# Altium schematic sheet connectors.SchDoc: Title
size B; Organization: Midnight Sun Solar Rayce Car Team; Address1: University of Waterloo; Address2: 200 University Ave W; Address3: Waterloo, ON, Canada; Address4: N2L 3E9; Website: www.uwmidsun.com; ProjectName: ProjectName
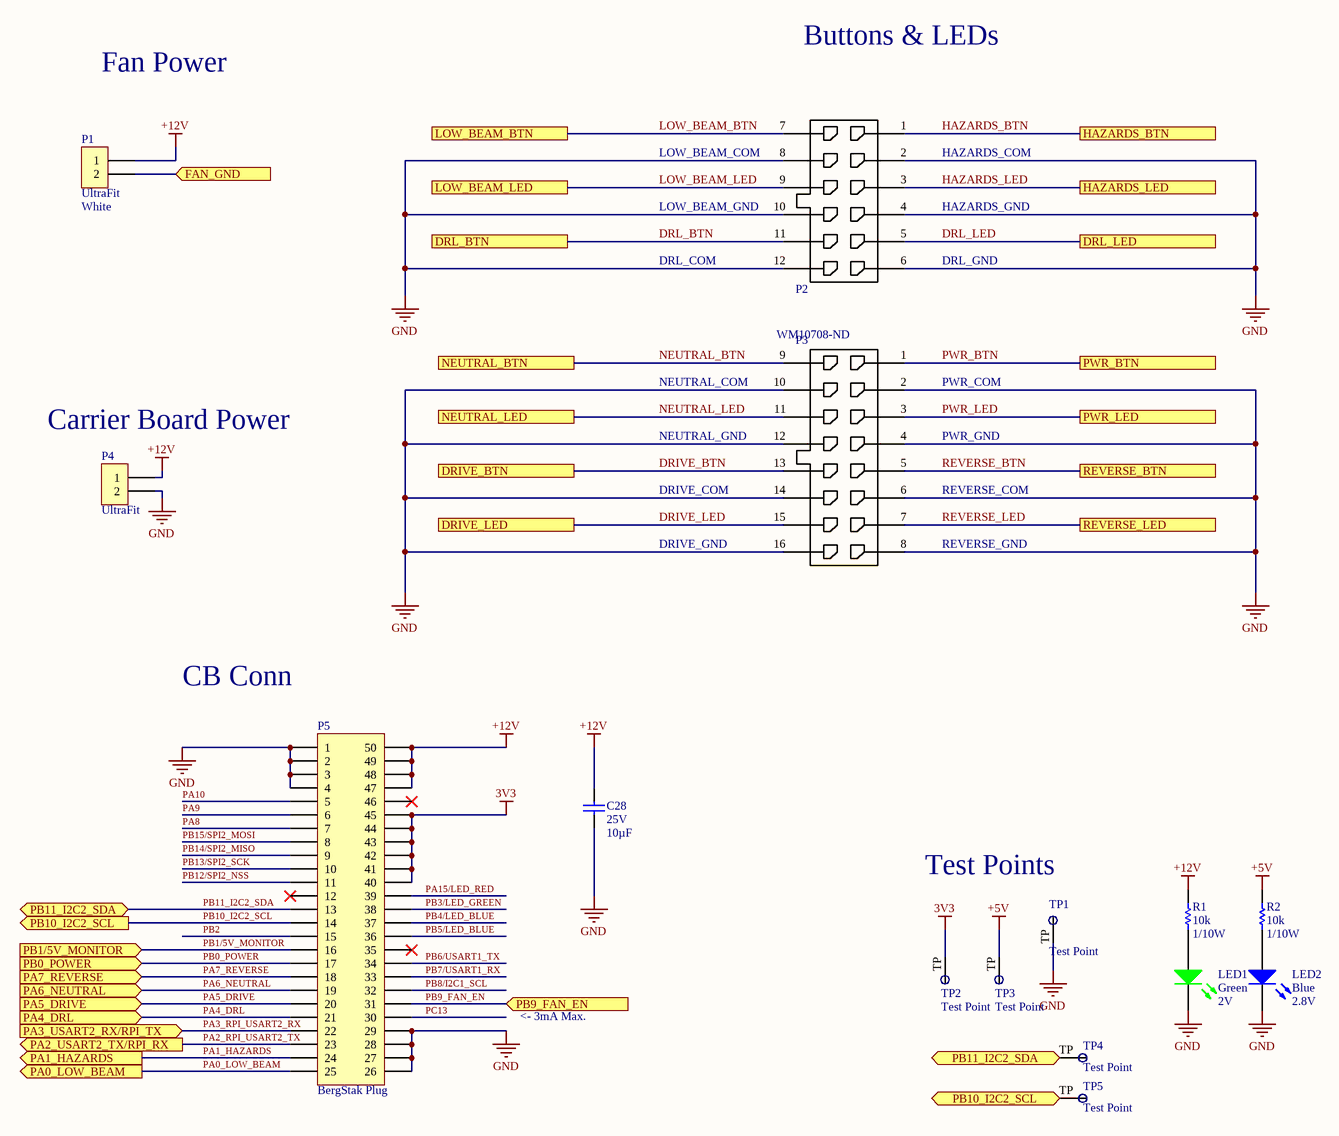
[diagram p0: connectors.SchDoc]

## Parts
C28  Voltage - Rated: 25V  Capacitance: 10µF  [CAP, 0805]  (hidden comment: CAP CER 10uF 25V 10% X5R 0805)
LED1  Color: Green  Voltage - Forward (Vf) (Typ): 2V  [LED_0603]  (hidden comment: LED GREEN CLEAR 2V 0603)
LED2  Color: Blue  Voltage - Forward (Vf) (Typ): 2.8V  [LED_0603]  (hidden comment: LED BLUE CLEAR 2.8V 0603)
P1  Series: UltraFit  Color: White  [CONN, 2POS ULTRA-FIT - NATURAL COLOR]  (hidden comment: CONN 2POS ULTRA-FIT NATURAL COLOR 0.138")
P2  CONN 12POS MICRO-FIT 3mm  [CONN, 12POS MICRO-FIT 3mm]  (value not drawn)
P3  Supplier Part Number 1: WM10708-ND  [CONN, 16POS MICRO-FIT 3MM]  (hidden comment: CONN 16POS MICRO-FIT 3mm)
P4  Series: UltraFit  [CONN, 2POS ULTRA-FIT]  (hidden comment: CONN 2POS ULTRA-FIT 0.138")
P5  Series: BergStak Plug  [CONN, Bergstak 50 Pos Plug]  (hidden comment: CONN 50POS Bergstak Plug 0.02")
R1  Resistance: 10k  Power: 1/10W  [RES, 0603]  (hidden comment: RES 10K OHM 1% 1/10W 0603)
R2  Resistance: 10k  Power: 1/10W  [RES, 0603]  (hidden comment: RES 10K OHM 1% 1/10W 0603)
TP1  Test Point  [Test Point]  (no BOM)
TP2  Test Point  [Test Point]  (no BOM)
TP3  Test Point  [Test Point]  (no BOM)
TP4  Test Point  [Test Point]  (no BOM)
TP5  Test Point  [Test Point]  (no BOM)

## Ports
DRIVE_BTN, DRIVE_LED, DRL_BTN, DRL_LED, FAN_GND (in), HAZARDS_BTN, HAZARDS_LED, LOW_BEAM_BTN, LOW_BEAM_LED, NEUTRAL_BTN, NEUTRAL_LED, PA0_LOW_BEAM (out), PA1_HAZARDS (out), PA2_USART2_TX/RPI_RX (out), PA3_USART2_RX/RPI_TX (in), PA4_DRL (in), PA5_DRIVE (in), PA6_NEUTRAL (in), PA7_REVERSE (in), PB0_POWER (in), PB1/5V_MONITOR (in), PB9_FAN_EN (in), PB10_I2C2_SCL (bidir), PB10_I2C2_SCL (out), PB11_I2C2_SDA (bidir), PWR_BTN, PWR_LED, REVERSE_BTN, REVERSE_LED

## Nets
3V3: P5.40 P5.41 P5.42 P5.43 P5.44 P5.45 TP2.TP
+5V: R2.1 TP3.TP
+12V: C28.1 P1.1 P4.1 P5.47 P5.48 P5.49 P5.50 R1.1
GND: C28.2 LED1.2(K) LED2.2(K) P2.2 P2.4 P2.6 P2.8 P2.10 P2.12 P3.2 P3.4 P3.6 P3.8 P3.10 P3.12 P3.14 P3.16 P4.2 P5.1 P5.2 P5.3 P5.4 P5.26 P5.27 P5.28 P5.29 TP1.TP
DRIVE_BTN: P3.13 ; port DRIVE_BTN
DRIVE_LED: P3.15 ; port DRIVE_LED
DRL_BTN: P2.11 ; port DRL_BTN
DRL_LED: P2.5 ; port DRL_LED
FAN_GND: P1.2 ; port FAN_GND
HAZARDS_BTN: P2.1 ; port HAZARDS_BTN
HAZARDS_LED: P2.3 ; port HAZARDS_LED
LOW_BEAM_BTN: P2.7 ; port LOW_BEAM_BTN
LOW_BEAM_LED: P2.9 ; port LOW_BEAM_LED
NEUTRAL_BTN: P3.9 ; port NEUTRAL_BTN
NEUTRAL_LED: P3.11 ; port NEUTRAL_LED
PA0_LOW_BEAM: P5.25 ; port PA0_LOW_BEAM
PA1_HAZARDS: P5.24 ; port PA1_HAZARDS
PA2_RPI_USART2_TX: P5.23 ; port PA2_USART2_TX/RPI_RX
PA3_RPI_USART2_RX: P5.22 ; port PA3_USART2_RX/RPI_TX
PA4_DRL: P5.21 ; port PA4_DRL
PA5_DRIVE: P5.20 ; port PA5_DRIVE
PA6_NEUTRAL: P5.19 ; port PA6_NEUTRAL
PA7_REVERSE: P5.18 ; port PA7_REVERSE
PA8: P5.7
PA9: P5.6
PA10: P5.5
PA15/LED_RED: P5.39
PB0_POWER: P5.17 ; port PB0_POWER
PB1/5V_MONITOR: P5.16 ; port PB1/5V_MONITOR
PB2: P5.15
PB3/LED_GREEN: P5.38
PB4/LED_BLUE: P5.37
PB5/LED_BLUE: P5.36
PB6/USART1_TX: P5.34
PB7/USART1_RX: P5.33
PB8/I2C1_SCL: P5.32
PB9_FAN_EN: P5.31 ; port PB9_FAN_EN
PB10_I2C2_SCL: P5.14 TP5.TP ; port PB10_I2C2_SCL
PB11_I2C2_SDA: P5.13 TP4.TP ; port PB11_I2C2_SDA
PB12/SPI2_NSS: P5.11
PB13/SPI2_SCK: P5.10
PB14/SPI2_MISO: P5.9
PB15/SPI2_MOSI: P5.8
PC13: P5.30
PWR_BTN: P3.1 ; port PWR_BTN
PWR_LED: P3.3 ; port PWR_LED
REVERSE_BTN: P3.5 ; port REVERSE_BTN
REVERSE_LED: P3.7 ; port REVERSE_LED
NetLED1_1: LED1.1(A) R1.2
NetLED2_1: LED2.1(A) R2.2

Not connected (* = marked no-connect by the designer): P5 12* 35* 46*

## Notes on the sheet
- Buttons & LEDs
- Fan Power
- LOW_BEAM_COM
- HAZARDS_COM
- LOW_BEAM_GND
- DRL_COM
- HAZARDS_GND
- DRL_GND
- NEUTRAL_COM
- PWR_COM
- (near P4) Carrier Board Power
- NEUTRAL_GND
- PWR_GND
- DRIVE_COM
- REVERSE_COM
- DRIVE_GND
- REVERSE_GND
- CB Conn
- (near TP1) Test Points
- <- 3mA Max.
- PROJECT
- DOCUMENT
- DRAWN BY
- LAST MODIFIED
- PART NUMBER
- REVISION
- SHEET
- VARIANT
- OF
- Engineering 5 - 1002
  University of Waterloo
  (519) 888-4567 x32978
  hardware@uwmidsun.com

## Library data of the parts
C28 = CAP CER 10uF 25V 10% X5R 0805: 10µF ±10% 25V Ceramic Capacitor X5R 0805 (2012 Metric); Manufacturer: Murata Electronics North America; Manufacturer Part Number: GRM21BR61E106KA73L; Supplier 1: Digi-Key; RoHS: RoHS Compliant; Category: Capacitors; Stock 1: 1695157; Packaging: Cut Tape (CT); Part Status: Active; Tolerance: ±10%; Temperature Coefficient: X5R; Operating Temperature: -55°C ~ 85°C; Features: -; Ratings: -; Applications: General Purpose; Mounting Type: Surface Mount, MLCC; Package / Case: 0805 (2012 Metric); Size / Dimension: 0.079" L x 0.049" W (2.00mm x 1.25mm); Height - Seated (Max): -; Thickness (Max): 0.053" (1.35mm); Lead Spacing: -; Lead Style: -; ComponentLink1URL: http://search.murata.co.jp/Ceramy/image/img/A01X/G101/ENG/GRM21BR61E106KA73-01.pdf; ComponentLink1Description: http://search.murata.co.jp/Ceramy/image/img/A01X/G101/ENG/GRM21BR61E106KA73-01.pdf; Supplier Part Number 1: 490-5523-1-ND; Pricing 1: 1=0.3, 10=0.214, 100=0.1008, 500=0.07068, 1000=0.05851 (CAD)
LED1 = LED GREEN CLEAR 2V 0603: Green 572nm LED Indication - Discrete 2V 0603 (1608 Metric); Manufacturer: Wurth Electronics Inc.; Manufacturer Part Number: 150060VS75000; Lens Color: Colorless; Millicandela Rating: 40mcd; Lens Style/Size: Rectangle with Flat Top, 1.10mm x 0.70mm; Current - Test: 20mA; Viewing Angle: 140°; Wavelength - Dominant: 570nm; Supplier 1: Digi-Key; RoHS: RoHS Compliant; Category: Optoelectronics; Stock 1: 9408; Pricing 1: 1=0.21, 100=0.1617, 500=0.13964 (CAD); Packaging: Cut Tape (CT); Part Status: Active; Lens Transparency: Clear; Mounting Type: Surface Mount; Wavelength - Peak: 572nm; Features: -; Package / Case: 0603 (1608 Metric); Supplier Device Package: 0603; Size / Dimension: 1.60mm L x 0.80mm W; Height (Max): 0.80mm; ComponentLink1URL: http://katalog.we-online.de/led/datasheet/150060VS75000.pdf; ComponentLink1Description: http://katalog.we-online.de/led/datasheet/150060VS75000.pdf; Supplier Part Number 1: 732-4980-1-ND
LED2 = LED BLUE CLEAR 2.8V 0603: Blue 470nm LED Indication - Discrete 2.8V 0603 (1608 Metric); Manufacturer 1: Lite-On Inc.; Manufacturer Part Number 1: LTST-C193TBKT-5A; Lens Color: Colorless; Millicandela Rating: 15mcd; Lens Style/Size: Rectangle with Flat Top, 1.15mm x 0.80mm; Current - Test: 5mA; Viewing Angle: 130°; Wavelength - Peak: 468nm; Supplier 1: Digi-Key; Supplier Part Number 1: 160-1827-1-ND; Packaging: Cut Tape (CT); Part Status: Active; Lens Transparency: Clear; Mounting Type: Surface Mount; Wavelength - Dominant: 470nm; Package / Case: 0603 (1608 Metric); Supplier Device Package: Chip LED; Size / Dimension: 1.60mm L x 0.80mm W; Height (Max): 0.45mm; ComponentLink1URL: http://optoelectronics.liteon.com/upload/download/DS22-2004-060/P_100_LTST-C193TBKT-5A.pdf; ComponentLink1Description: http://optoelectronics.liteon.com/upload/download/DS22-2004-060/P_100_LTST-C193TBKT-5A.pdf
P1 = CONN 2POS ULTRA-FIT NATURAL COLOR 0.138": 2 Positions Header, Shrouded Connector 0.138" (3.50mm) Through Hole; Manufacturer 1: Molex, LLC; Manufacturer Part Number 1: 1722872102; Style: Board to Cable/Wire; Shrouding: Shrouded - 4 Wall; Number of Positions: 2; Number of Positions Loaded: All; Contact Length - Post: 0.126" (3.20mm); Material Flammability Rating: UL94 V-0; Mated Stacking Heights: 26.99mm; Voltage: 400V; Supplier 1: Digi-Key; Supplier Part Number 1: WM11722-ND; Packaging: Tray; Part Status: Active; Connector Type: Header; Contact Type: Male Pin; Pitch - Mating: 0.138" (3.50mm); Number of Rows: 1; Row Spacing - Mating: -; Mounting Type: Through Hole; Termination: Solder; Fastening Type: Latch Holder; Contact Length - Mating: -; Overall Contact Length: -; Insulation Height: 0.465" (11.80mm); Contact Shape: Square; Contact Finish - Mating: Tin; Contact Finish Thickness - Mating: 60µin (1.52µm); Contact Finish - Post: Tin; Contact Material: Copper Alloy; Insulation Material: Liquid Crystal Polymer (LCP); Operating Temperature: -40°C ~ 105°C; Ingress Protection: -; Insulation Color: Natural; Current Rating: -; Contact Finish Thickness - Post: 60µin (1.52µm); ComponentLink1URL: http://www.molex.com/pdm_docs/sd/1722872102_sd.pdf; ComponentLink1Description: http://www.molex.com/pdm_docs/sd/1722872102_sd.pdf
P2 = CONN 12POS MICRO-FIT 3mm: Connector Header Through Hole 12 position 0.118" (3.00mm); Manufacturer: Molex, LLC; Manufacturer Part Number: 0430451227; Number of Positions: 12; Number of Positions Loaded: All; Style: Board to Cable/Wire; Shrouding: Shrouded - 4 Wall; Contact Length - Post: 0.125" (3.18mm); Material Flammability Rating: UL94 V-0; Supplier 1: Digi-Key; RoHS: RoHS Compliant; Category: Connectors, Interconnects; Stock 1: 1709; Pricing 1: 1=3.61, 10=3.283, 25=3.0816, 50=2.9478, 100=2.8138, 250=2.5458, 500=2.34482, 1008=2.00985, 3024=1.87586 (CAD); Packaging: Tray; Part Status: Active; Connector Type: Header; Contact Type: Male Pin; Pitch - Mating: 0.118" (3.00mm); Number of Rows: 2; Row Spacing - Mating: 0.118" (3.00mm); Mounting Type: Through Hole; Termination: Solder; Fastening Type: Locking Ramp; Contact Length - Mating: -; Overall Contact Length: -; Insulation Height: 0.390" (9.91mm); Contact Shape: Square; Contact Finish - Mating: Tin; Contact Finish Thickness - Mating: 60.0µin (1.52µm); Contact Finish - Post: Tin; Contact Material: Brass; Insulation Material: Liquid Crystal Polymer (LCP), Glass Filled; Features: Board Guide; Operating Temperature: -; Ingress Protection: -; Insulation Color: Black; Current Rating: -; Voltage Rating: -; Mated Stacking Heights: -; Contact Finish Thickness - Post: -; Applications: General Purpose, Medical, Military, Telecommunications; ComponentLink1URL: https://www.molex.com/pdm_docs/sd/430451227_sd.pdf; ComponentLink1Description: https://www.molex.com/pdm_docs/sd/430451227_sd.pdf; Supplier Part Number 1: WM10697-ND
P3 = CONN 16POS MICRO-FIT 3mm: Connector Header Through Hole 16 position 0.118"(3.00mm); Manufacturer: Molex; Manufacturer Part Number: 0430451627; Contact Resistance: 10mR; Number of Positions: 16; Number of Ports: 1; Connector Type: Male Pin; Row Spacing: 0.118inch; Supplier 1: Digi-Key; RoHS: Yes; Stock 1: 4654; Pricing 1: 1 = 3.26000, 10 = 3.12900, 25 = 2.86800, 50 = 2.73780, 100 = 2.60740, 250 = 2.28148, 792 = 2.02073, 1584 = 1.82518, 3168 = 1.75999 (USD); Mount: Through Hole; Color: Black; Contact Material: Brass; Contact Plating: Tin; Number of Terminals: 16; Housing Color: Black; Housing Material: Polymer; Min Operating Temperature: -40°C; Max Operating Temperature: 105°C; Package Quantity: 792; Number of Rows: 2; Fastening Type: Ramp; Packaging: Tray; Termination: Solder; Number of Contacts: 16; Orientation: Straight; Length: 28.15mm; Pitch: 3mm; Depth: 8.77mm; ComponentLink1URL: http://www.molex.com/pdm_docs/sd/430451627_sd.pdf; ComponentLink1Description: http://www.molex.com/pdm_docs/sd/430451627_sd.pdf; ComponentLink2URL: http://www.molex.com/webdocs/datasheets/pdf/en-us/0430451627_PCB_HEADERS.pdf; ComponentLink2Description: http://www.molex.com/webdocs/datasheets/pdf/en-us/0430451627_PCB_HEADERS.pdf
P4 = CONN 2POS ULTRA-FIT 0.138": 2 Positions Header, Shrouded Connector 0.138" (3.50mm) Through Hole Gold; Manufacturer 1: Molex, LLC; Manufacturer Part Number 1: 1722861302; Style: Board to Board or Cable; Shrouding: Shrouded - 4 Wall; Number of Positions: 2; Number of Positions Loaded: All; Contact Length - Post: 0.126" (3.20mm); Material Flammability Rating: UL94 V-0; Mated Stacking Heights: 26.99mm; Voltage: 400V; Supplier 1: Digi-Key; Supplier Part Number 1: WM11673-ND; Packaging: Tray; Part Status: Active; Connector Type: Header; Contact Type: Male Pin; Pitch - Mating: 0.138" (3.50mm); Number of Rows: 1; Row Spacing - Mating: -; Mounting Type: Through Hole; Termination: Kinked Pin, Solder; Fastening Type: Latch Holder; Contact Length - Mating: -; Overall Contact Length: -; Insulation Height: 0.465" (11.80mm); Contact Shape: Square; Contact Finish - Mating: Gold; Contact Finish Thickness - Mating: 30µin (0.76µm); Contact Finish - Post: Tin; Contact Material: Copper Alloy; Insulation Material: Liquid Crystal Polymer (LCP); Operating Temperature: -40°C ~ 120°C; Ingress Protection: -; Insulation Color: Black; Current Rating: -; Contact Finish Thickness - Post: 60µin (1.52µm); ComponentLink1URL: http://www.molex.com/pdm_docs/sd/1722861302_sd.pdf; ComponentLink1Description: http://www.molex.com/pdm_docs/sd/1722861302_sd.pdf
P5 = CONN 50POS Bergstak Plug 0.02": 50 Position Connector Plug, Outer Shroud Contacts Surface Mount Gold; Manufacturer 1: Amphenol FCI; Manufacturer Part Number 1: 10132797-055100LF; Number of Positions: 50; Mated Stacking Heights: 5mm; Pitch: 0.020" (0.50mm); Supplier 1: Digi-Key; Supplier Part Number 1: 609-5226-1-ND; Packaging: Cut Tape (CT); Part Status: Active; Connector Type: Plug, Outer Shroud Contacts; Number of Rows: 2; Mounting Type: Surface Mount; Contact Finish: Gold; Contact Finish Thickness: 1µin (0.025µm); Height Above Board: 0.169" (4.30mm); ComponentLink1URL: http://portal.fciconnect.com/Comergent//fci/drawing/10132797.pdf; ComponentLink1Description: http://portal.fciconnect.com/Comergent//fci/drawing/10132797.pdf
R1 R2 = RES 10K OHM 1% 1/10W 0603: RES SMD 10K OHM 1% 1/10W 0603; Manufacturer 1: Yageo; Manufacturer Part Number 1: RC0603FR-0710KL; Temperature Coefficient: ±100ppm/°C; Supplier 1: Digi-Key; Supplier Part Number 1: 311-10.0KHRCT-ND; Packaging: Cut Tape (CT); Part Status: Active; Composition: Thick Film; Operating Temperature: -55°C ~ 155°C; Package / Case: 0603 (1608 Metric); Supplier Device Package: 0603; Size / Dimension: 0.063" L x 0.031" W (1.60mm x 0.80mm); Height - Seated (Max): 0.022" (0.55mm); Failure Rate: -; ComponentLink1URL: http://www.yageo.com/documents/recent/PYu-RC_Group_51_RoHS_L_7.pdf; ComponentLink1Description: http://www.yageo.com/documents/recent/PYu-RC_Group_51_RoHS_L_7.pdf; Tolerance: ±1%